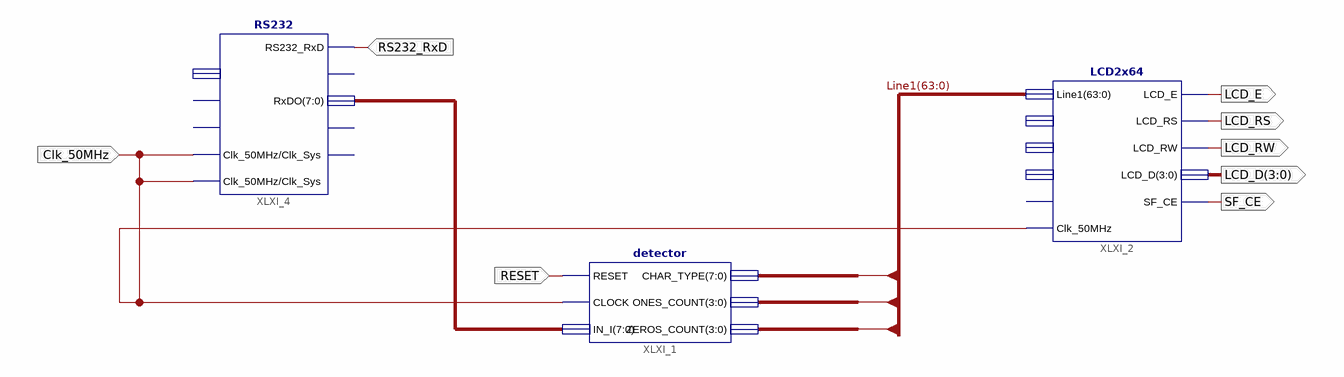
[diagram p0: schematic sheet 1]
// Xilinx ISE schematic sch.sch (spartan3e) as structural Verilog: 3 symbols, 8 ports
module sch (
  input  Clk_50MHz,
  input  RS232_RxD,
  input  RESET,
  output LCD_E,
  output LCD_RS,
  output LCD_RW,
  output [3:0] LCD_D,
  output SF_CE
);

  wire [7:0] XLXN_4;
  wire [63:0] Line1;

  detector XLXI_1 (
    .RESET(RESET), .CLOCK(Clk_50MHz), .IN_I(XLXN_4), .CHAR_TYPE(Line1[7:0]), .ONES_COUNT(Line1[11:8]),
    .ZEROS_COUNT(Line1[15:12]));
  LCD2x64 XLXI_2 (
    .Line1(Line1), .LCD_D(LCD_D), .LCD_E(LCD_E), .LCD_RW(LCD_RW), .LCD_RS(LCD_RS), .SF_CE(SF_CE),
    .Clk_50MHz(Clk_50MHz));  // open: Blank1, Line2, Blank2, Reset
  RS232 XLXI_4 (
    .Clk_50MHz(Clk_50MHz), .RS232_RxD(RS232_RxD), .RxDO(XLXN_4), .Clk_Sys(Clk_50MHz));  // open: Reset, TxStart, TxDI, TxBusy, RxRdy, RS232_TxD
endmodule
